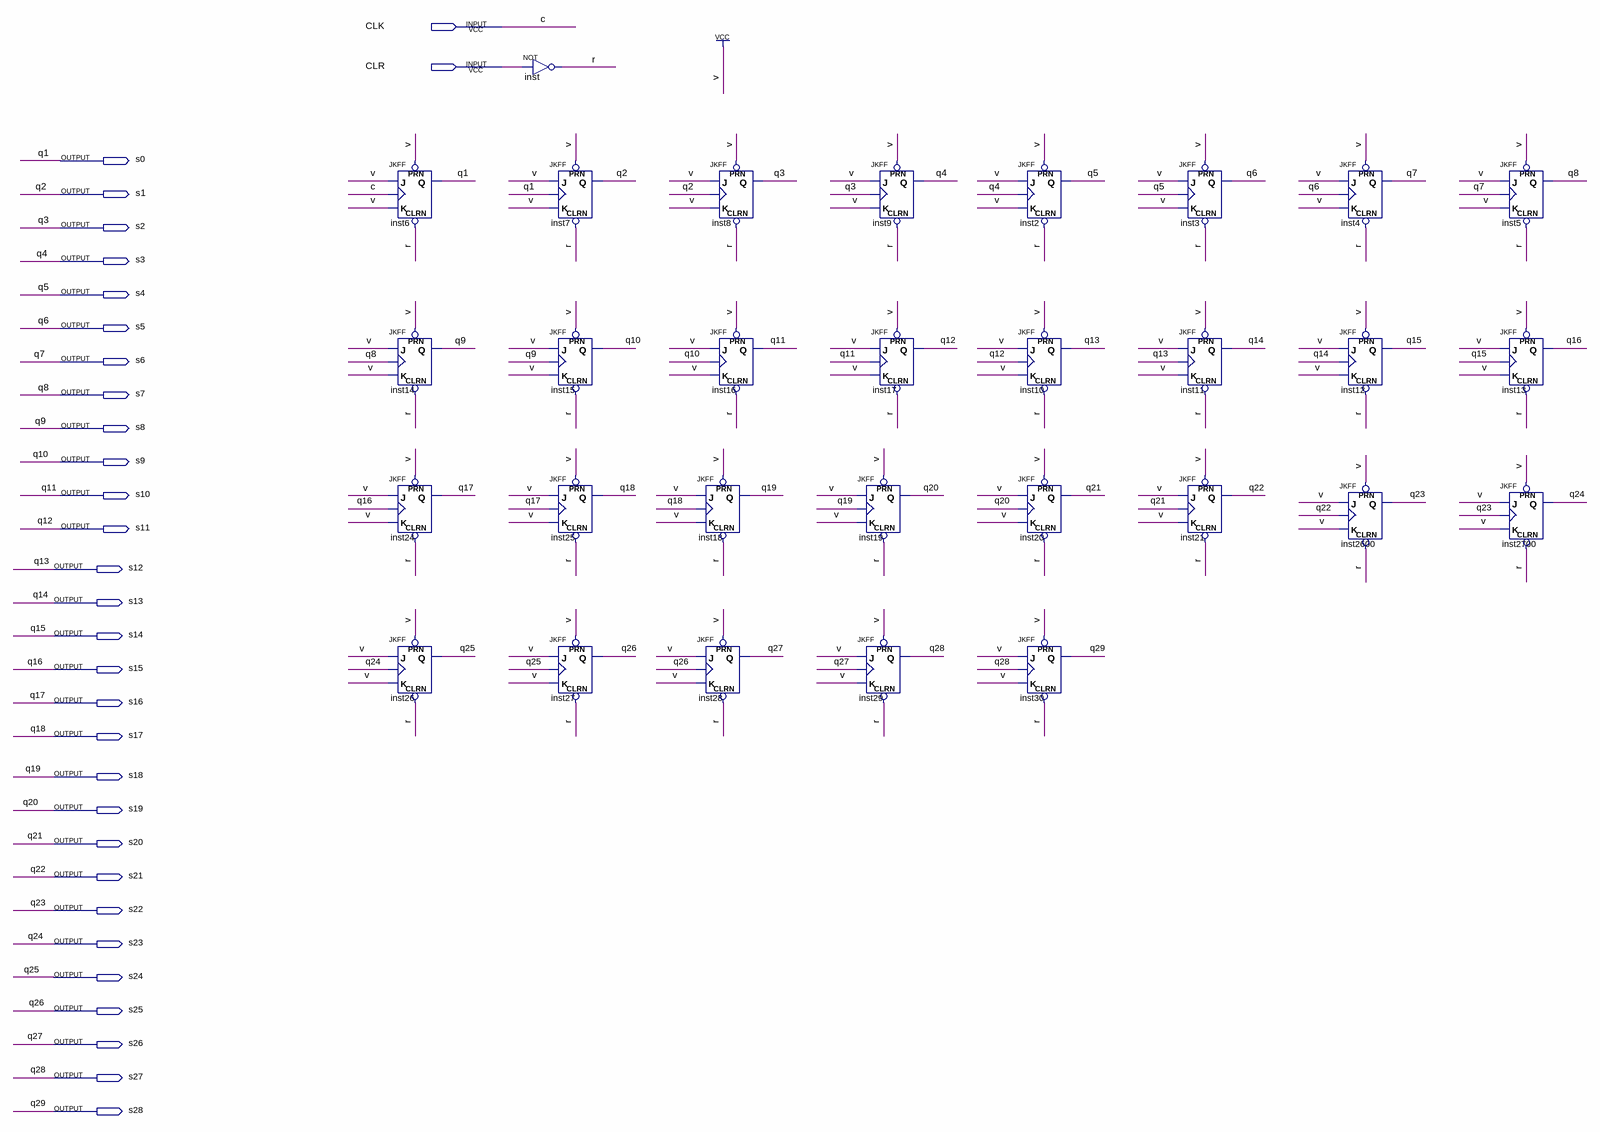
[diagram p0: schematic sheet]
// Quartus schematic Divisor_Frequencia.bdf as structural Verilog: 30 symbols, 31 pins
module Divisor_Frequencia (
  input  CLK,
  input  CLR,
  output s0,
  output s1,
  output s2,
  output s3,
  output s4,
  output s5,
  output s6,
  output s7,
  output s8,
  output s9,
  output s10,
  output s11,
  output s12,
  output s13,
  output s14,
  output s15,
  output s16,
  output s17,
  output s18,
  output s19,
  output s20,
  output s21,
  output s22,
  output s23,
  output s24,
  output s25,
  output s26,
  output s27,
  output s28
);

  wire r;

  JKFF inst6 (.PRN(1'b1), .CLRN(r), .K(1'b1), .J(1'b1), .CLK(CLK), .Q(s0));
  JKFF inst14 (.PRN(1'b1), .CLRN(r), .K(1'b1), .J(1'b1), .CLK(s7), .Q(s8));
  JKFF inst24 (.PRN(1'b1), .CLRN(r), .K(1'b1), .J(1'b1), .CLK(s15), .Q(s16));
  JKFF inst26 (.PRN(1'b1), .CLRN(r), .K(1'b1), .J(1'b1), .CLK(s23), .Q(s24));
  not inst (r, CLR);
  JKFF inst7 (.PRN(1'b1), .CLRN(r), .K(1'b1), .J(1'b1), .CLK(s0), .Q(s1));
  JKFF inst15 (.PRN(1'b1), .CLRN(r), .K(1'b1), .J(1'b1), .CLK(s8), .Q(s9));
  JKFF inst25 (.PRN(1'b1), .CLRN(r), .K(1'b1), .J(1'b1), .CLK(s16), .Q(s17));
  JKFF inst27 (.PRN(1'b1), .CLRN(r), .K(1'b1), .J(1'b1), .CLK(s24), .Q(s25));
  JKFF inst18 (.PRN(1'b1), .CLRN(r), .K(1'b1), .J(1'b1), .CLK(s17), .Q(s18));
  JKFF inst28 (.PRN(1'b1), .CLRN(r), .K(1'b1), .J(1'b1), .CLK(s25), .Q(s26));
  JKFF inst8 (.PRN(1'b1), .CLRN(r), .K(1'b1), .J(1'b1), .CLK(s1), .Q(s2));
  JKFF inst16 (.PRN(1'b1), .CLRN(r), .K(1'b1), .J(1'b1), .CLK(s9), .Q(s10));
  JKFF inst19 (.PRN(1'b1), .CLRN(r), .K(1'b1), .J(1'b1), .CLK(s18), .Q(s19));
  JKFF inst29 (.PRN(1'b1), .CLRN(r), .K(1'b1), .J(1'b1), .CLK(s26), .Q(s27));
  JKFF inst9 (.PRN(1'b1), .CLRN(r), .K(1'b1), .J(1'b1), .CLK(s2), .Q(s3));
  JKFF inst17 (.PRN(1'b1), .CLRN(r), .K(1'b1), .J(1'b1), .CLK(s10), .Q(s11));
  JKFF inst2 (.PRN(1'b1), .CLRN(r), .K(1'b1), .J(1'b1), .CLK(s3), .Q(s4));
  JKFF inst10 (.PRN(1'b1), .CLRN(r), .K(1'b1), .J(1'b1), .CLK(s11), .Q(s12));
  JKFF inst20 (.PRN(1'b1), .CLRN(r), .K(1'b1), .J(1'b1), .CLK(s19), .Q(s20));
  JKFF inst30 (.PRN(1'b1), .CLRN(r), .K(1'b1), .J(1'b1), .CLK(s27), .Q(s28));
  JKFF inst3 (.PRN(1'b1), .CLRN(r), .K(1'b1), .J(1'b1), .CLK(s4), .Q(s5));
  JKFF inst11 (.PRN(1'b1), .CLRN(r), .K(1'b1), .J(1'b1), .CLK(s12), .Q(s13));
  JKFF inst21 (.PRN(1'b1), .CLRN(r), .K(1'b1), .J(1'b1), .CLK(s20), .Q(s21));
  JKFF inst4 (.PRN(1'b1), .CLRN(r), .K(1'b1), .J(1'b1), .CLK(s5), .Q(s6));
  JKFF inst12 (.PRN(1'b1), .CLRN(r), .K(1'b1), .J(1'b1), .CLK(s13), .Q(s14));
  JKFF inst2600 (.PRN(1'b1), .CLRN(r), .K(1'b1), .J(1'b1), .CLK(s21), .Q(s22));
  JKFF inst5 (.PRN(1'b1), .CLRN(r), .K(1'b1), .J(1'b1), .CLK(s6), .Q(s7));
  JKFF inst13 (.PRN(1'b1), .CLRN(r), .K(1'b1), .J(1'b1), .CLK(s14), .Q(s15));
  JKFF inst2700 (.PRN(1'b1), .CLRN(r), .K(1'b1), .J(1'b1), .CLK(s22), .Q(s23));

  // Other names for the same wires on the sheet: c = CLK; q1 = s0; q2 = s1; q3 = s2; q4 = s3; q5 = s4; q6 = s5;
  //   q7 = s6; q8 = s7; q9 = s8; q10 = s9; q11 = s10; q12 = s11; q13 = s12; q14 = s13; q15 = s14; q16 = s15;
  //   q17 = s16; q18 = s17; q19 = s18; q20 = s19; q21 = s20; q22 = s21; q23 = s22; q24 = s23; q25 = s24; q26 = s25;
  //   q27 = s26; q28 = s27; q29 = s28
endmodule
